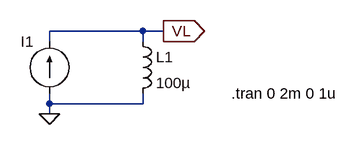
[diagram p0: schematic inductor.asc]
inductor.asc, the LTspice schematic file:
Version 4
SHEET 1 880 680
WIRE 304 224 160 224
WIRE 336 224 304 224
WIRE 160 240 160 224
WIRE 304 240 304 224
WIRE 160 336 160 320
WIRE 304 336 304 320
WIRE 304 336 160 336
WIRE 160 352 160 336
FLAG 160 352 0
FLAG 336 224 VL
IOPIN 336 224 Out
SYMBOL current 160 320 R180
WINDOW 0 24 80 Left 2
WINDOW 3 24 0 Invisible 2
SYMATTR InstName I1
SYMATTR Value SINE(0 100m 1000)
SYMBOL ind 288 224 R0
SYMATTR InstName L1
SYMATTR Value 100µ
TEXT 440 320 Left 2 !.tran 0 2m 0 1u

The netlist it stands for:
* inductor.asc
I1 0 VL SINE(0 100m 1000)
L1 VL 0 100µ
.tran 0 2m 0 1u
.backanno
.end